# Altium schematic sheet Voices_All.SCHDOC
size B; Organization: Altium Limited; Address1: L3, 12a Rodborough Rd; Address2: Frenchs Forest; Address3: NSW; Address4: Australia 2086; DocumentNumber: 4; SheetNumber: 4; SheetTotal: 9
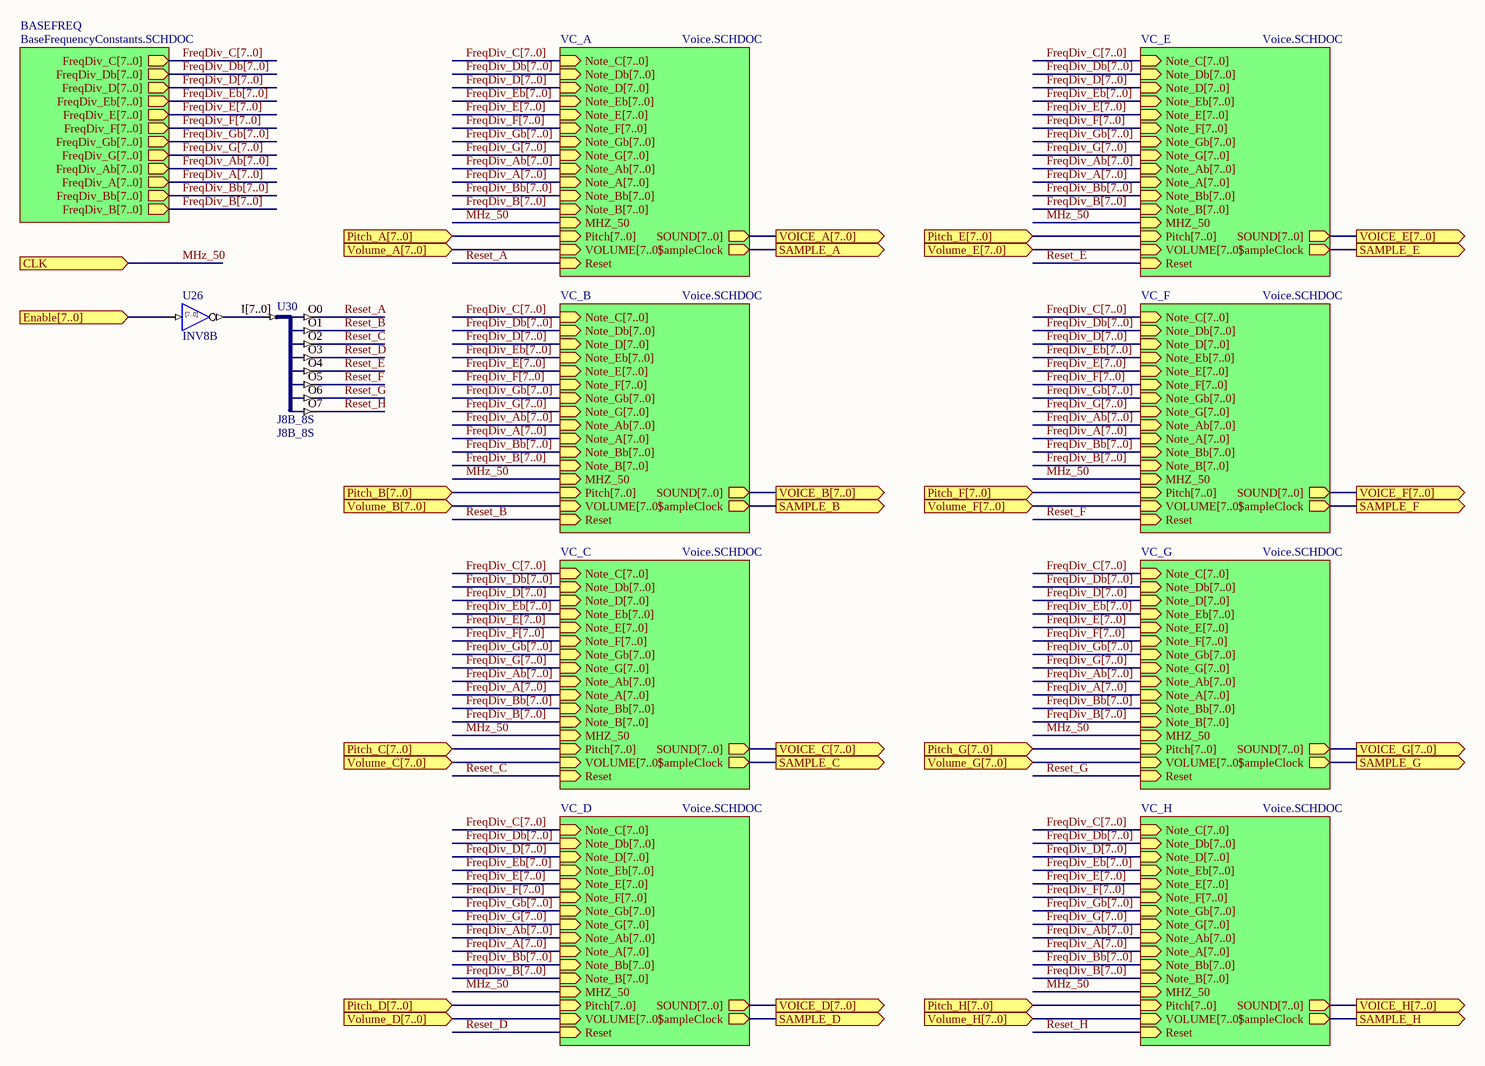
[diagram p0: Voices_All.SCHDOC]

## Parts
U26  INV8B
U30  J8B_8S

## Sub-sheets
BASEFREQ = BaseFrequencyConstants.SCHDOC: FreqDiv_C[7..0] (out), FreqDiv_A[7..0] (out), FreqDiv_B[7..0] (out), FreqDiv_Bb[7..0] (out), FreqDiv_D[7..0] (out), FreqDiv_Ab[7..0] (out), FreqDiv_G[7..0] (out), FreqDiv_Eb[7..0] (out), FreqDiv_E[7..0] (out), FreqDiv_Gb[7..0] (out), FreqDiv_F[7..0] (out), FreqDiv_Db[7..0] (out)
VC_A = Voice.SCHDOC: Note_C[7..0] (in), SampleClock (out), Note_A[7..0] (in), Note_B[7..0] (in), Note_Bb[7..0] (in), Note_D[7..0] (in), Note_Ab[7..0] (in), Note_G[7..0] (in), MHZ_50 (in), Note_Eb[7..0] (in), Pitch[7..0] (in), Note_E[7..0] (in), Note_Gb[7..0] (in), Note_F[7..0] (in), Note_Db[7..0] (in), Reset (in), SOUND[7..0] (out), VOLUME[7..0] (in)
VC_B = Voice.SCHDOC: Note_C[7..0] (in), SampleClock (out), Note_A[7..0] (in), Note_B[7..0] (in), Note_Bb[7..0] (in), Note_D[7..0] (in), Note_Ab[7..0] (in), Note_G[7..0] (in), MHZ_50 (in), Note_Eb[7..0] (in), Pitch[7..0] (in), Note_E[7..0] (in), Note_Gb[7..0] (in), Note_F[7..0] (in), Note_Db[7..0] (in), Reset (in), SOUND[7..0] (out), VOLUME[7..0] (in)
VC_C = Voice.SCHDOC: Note_C[7..0] (in), SampleClock (out), Note_A[7..0] (in), Note_B[7..0] (in), Note_Bb[7..0] (in), Note_D[7..0] (in), Note_Ab[7..0] (in), Note_G[7..0] (in), MHZ_50 (in), Note_Eb[7..0] (in), Pitch[7..0] (in), Note_E[7..0] (in), Note_Gb[7..0] (in), Note_F[7..0] (in), Note_Db[7..0] (in), Reset (in), SOUND[7..0] (out), VOLUME[7..0] (in)
VC_D = Voice.SCHDOC: Note_C[7..0] (in), SampleClock (out), Note_A[7..0] (in), Note_B[7..0] (in), Note_Bb[7..0] (in), Note_D[7..0] (in), Note_Ab[7..0] (in), Note_G[7..0] (in), MHZ_50 (in), Note_Eb[7..0] (in), Pitch[7..0] (in), Note_E[7..0] (in), Note_Gb[7..0] (in), Note_F[7..0] (in), Note_Db[7..0] (in), Reset (in), SOUND[7..0] (out), VOLUME[7..0] (in)
VC_E = Voice.SCHDOC: Note_C[7..0] (in), SampleClock (out), Note_A[7..0] (in), Note_B[7..0] (in), Note_Bb[7..0] (in), Note_D[7..0] (in), Note_Ab[7..0] (in), Note_G[7..0] (in), MHZ_50 (in), Note_Eb[7..0] (in), Pitch[7..0] (in), Note_E[7..0] (in), Note_Gb[7..0] (in), Note_F[7..0] (in), Note_Db[7..0] (in), Reset (in), SOUND[7..0] (out), VOLUME[7..0] (in)
VC_F = Voice.SCHDOC: Note_C[7..0] (in), SampleClock (out), Note_A[7..0] (in), Note_B[7..0] (in), Note_Bb[7..0] (in), Note_D[7..0] (in), Note_Ab[7..0] (in), Note_G[7..0] (in), MHZ_50 (in), Note_Eb[7..0] (in), Pitch[7..0] (in), Note_E[7..0] (in), Note_Gb[7..0] (in), Note_F[7..0] (in), Note_Db[7..0] (in), Reset (in), SOUND[7..0] (out), VOLUME[7..0] (in)
VC_G = Voice.SCHDOC: Note_C[7..0] (in), SampleClock (out), Note_A[7..0] (in), Note_B[7..0] (in), Note_Bb[7..0] (in), Note_D[7..0] (in), Note_Ab[7..0] (in), Note_G[7..0] (in), MHZ_50 (in), Note_Eb[7..0] (in), Pitch[7..0] (in), Note_E[7..0] (in), Note_Gb[7..0] (in), Note_F[7..0] (in), Note_Db[7..0] (in), Reset (in), SOUND[7..0] (out), VOLUME[7..0] (in)
VC_H = Voice.SCHDOC: Note_C[7..0] (in), SampleClock (out), Note_A[7..0] (in), Note_B[7..0] (in), Note_Bb[7..0] (in), Note_D[7..0] (in), Note_Ab[7..0] (in), Note_G[7..0] (in), MHZ_50 (in), Note_Eb[7..0] (in), Pitch[7..0] (in), Note_E[7..0] (in), Note_Gb[7..0] (in), Note_F[7..0] (in), Note_Db[7..0] (in), Reset (in), SOUND[7..0] (out), VOLUME[7..0] (in)

## Ports
CLK (in), Enable[7..0] (in), Pitch_A[7..0] (in), Pitch_B[7..0] (in), Pitch_C[7..0] (in), Pitch_D[7..0] (in), Pitch_E[7..0] (in), Pitch_F[7..0] (in), Pitch_G[7..0] (in), Pitch_H[7..0] (in), SAMPLE_A (out), SAMPLE_B (out), SAMPLE_C (out), SAMPLE_D (out), SAMPLE_E (out), SAMPLE_F (out), SAMPLE_G (out), SAMPLE_H (out), VOICE_A[7..0] (out), VOICE_B[7..0] (out), VOICE_C[7..0] (out), VOICE_D[7..0] (out), VOICE_E[7..0] (out), VOICE_F[7..0] (out), VOICE_G[7..0] (out), VOICE_H[7..0] (out), Volume_A[7..0] (in), Volume_B[7..0] (in), Volume_C[7..0] (in), Volume_D[7..0] (in), Volume_E[7..0] (in), Volume_F[7..0] (in), Volume_G[7..0] (in), Volume_H[7..0] (in)

## Nets
Enable[7..0]: U26.I[7..0] ; port Enable[7..0]
MHz_50: port CLK, sheet VC_A/MHZ_50, sheet VC_B/MHZ_50, sheet VC_C/MHZ_50, sheet VC_D/MHZ_50, sheet VC_E/MHZ_50, sheet VC_F/MHZ_50, sheet VC_G/MHZ_50, sheet VC_H/MHZ_50
Reset_A: U30.O0 ; sheet VC_A/Reset
Reset_B: U30.O1 ; sheet VC_B/Reset
Reset_C: U30.O2 ; sheet VC_C/Reset
Reset_D: U30.O3 ; sheet VC_D/Reset
Reset_E: U30.O4 ; sheet VC_E/Reset
Reset_F: U30.O5 ; sheet VC_F/Reset
Reset_G: U30.O6 ; sheet VC_G/Reset
Reset_H: U30.O7 ; sheet VC_H/Reset
SAMPLE_A: port SAMPLE_A, sheet VC_A/SampleClock
SAMPLE_B: port SAMPLE_B, sheet VC_B/SampleClock
SAMPLE_C: port SAMPLE_C, sheet VC_C/SampleClock
SAMPLE_D: port SAMPLE_D, sheet VC_D/SampleClock
SAMPLE_E: port SAMPLE_E, sheet VC_E/SampleClock
SAMPLE_F: port SAMPLE_F, sheet VC_F/SampleClock
SAMPLE_G: port SAMPLE_G, sheet VC_G/SampleClock
SAMPLE_H: port SAMPLE_H, sheet VC_H/SampleClock
NetU26_O[7..0]: U26.O[7..0] U30.I[7..0]

## Buses and harness runs
bus FreqDiv_A[7..0] = sheet BASEFREQ/FreqDiv_A[7..0]
bus FreqDiv_A[7..0] = sheet VC_A/Note_A[7..0]
bus FreqDiv_A[7..0] = sheet VC_B/Note_A[7..0]
bus FreqDiv_A[7..0] = sheet VC_C/Note_A[7..0]
bus FreqDiv_A[7..0] = sheet VC_D/Note_A[7..0]
bus FreqDiv_A[7..0] = sheet VC_E/Note_A[7..0]
bus FreqDiv_A[7..0] = sheet VC_F/Note_A[7..0]
bus FreqDiv_A[7..0] = sheet VC_G/Note_A[7..0]
bus FreqDiv_A[7..0] = sheet VC_H/Note_A[7..0]
bus FreqDiv_Ab[7..0] = sheet BASEFREQ/FreqDiv_Ab[7..0]
bus FreqDiv_Ab[7..0] = sheet VC_A/Note_Ab[7..0]
bus FreqDiv_Ab[7..0] = sheet VC_B/Note_Ab[7..0]
bus FreqDiv_Ab[7..0] = sheet VC_C/Note_Ab[7..0]
bus FreqDiv_Ab[7..0] = sheet VC_D/Note_Ab[7..0]
bus FreqDiv_Ab[7..0] = sheet VC_E/Note_Ab[7..0]
bus FreqDiv_Ab[7..0] = sheet VC_F/Note_Ab[7..0]
bus FreqDiv_Ab[7..0] = sheet VC_G/Note_Ab[7..0]
bus FreqDiv_Ab[7..0] = sheet VC_H/Note_Ab[7..0]
bus FreqDiv_B[7..0] = sheet BASEFREQ/FreqDiv_B[7..0]
bus FreqDiv_B[7..0] = sheet VC_A/Note_B[7..0]
bus FreqDiv_B[7..0] = sheet VC_B/Note_B[7..0]
bus FreqDiv_B[7..0] = sheet VC_C/Note_B[7..0]
bus FreqDiv_B[7..0] = sheet VC_D/Note_B[7..0]
bus FreqDiv_B[7..0] = sheet VC_E/Note_B[7..0]
bus FreqDiv_B[7..0] = sheet VC_F/Note_B[7..0]
bus FreqDiv_B[7..0] = sheet VC_G/Note_B[7..0]
bus FreqDiv_B[7..0] = sheet VC_H/Note_B[7..0]
bus FreqDiv_Bb[7..0] = sheet BASEFREQ/FreqDiv_Bb[7..0]
bus FreqDiv_Bb[7..0] = sheet VC_A/Note_Bb[7..0]
bus FreqDiv_Bb[7..0] = sheet VC_B/Note_Bb[7..0]
bus FreqDiv_Bb[7..0] = sheet VC_C/Note_Bb[7..0]
bus FreqDiv_Bb[7..0] = sheet VC_D/Note_Bb[7..0]
bus FreqDiv_Bb[7..0] = sheet VC_E/Note_Bb[7..0]
bus FreqDiv_Bb[7..0] = sheet VC_F/Note_Bb[7..0]
bus FreqDiv_Bb[7..0] = sheet VC_G/Note_Bb[7..0]
bus FreqDiv_Bb[7..0] = sheet VC_H/Note_Bb[7..0]
bus FreqDiv_C[7..0] = sheet BASEFREQ/FreqDiv_C[7..0]
bus FreqDiv_C[7..0] = sheet VC_A/Note_C[7..0]
bus FreqDiv_C[7..0] = sheet VC_B/Note_C[7..0]
bus FreqDiv_C[7..0] = sheet VC_C/Note_C[7..0]
bus FreqDiv_C[7..0] = sheet VC_D/Note_C[7..0]
bus FreqDiv_C[7..0] = sheet VC_E/Note_C[7..0]
bus FreqDiv_C[7..0] = sheet VC_F/Note_C[7..0]
bus FreqDiv_C[7..0] = sheet VC_G/Note_C[7..0]
bus FreqDiv_C[7..0] = sheet VC_H/Note_C[7..0]
bus FreqDiv_D[7..0] = sheet BASEFREQ/FreqDiv_D[7..0]
bus FreqDiv_D[7..0] = sheet VC_A/Note_D[7..0]
bus FreqDiv_D[7..0] = sheet VC_B/Note_D[7..0]
bus FreqDiv_D[7..0] = sheet VC_C/Note_D[7..0]
bus FreqDiv_D[7..0] = sheet VC_D/Note_D[7..0]
bus FreqDiv_D[7..0] = sheet VC_E/Note_D[7..0]
bus FreqDiv_D[7..0] = sheet VC_F/Note_D[7..0]
bus FreqDiv_D[7..0] = sheet VC_G/Note_D[7..0]
bus FreqDiv_D[7..0] = sheet VC_H/Note_D[7..0]
bus FreqDiv_Db[7..0] = sheet BASEFREQ/FreqDiv_Db[7..0]
bus FreqDiv_Db[7..0] = sheet VC_A/Note_Db[7..0]
bus FreqDiv_Db[7..0] = sheet VC_B/Note_Db[7..0]
bus FreqDiv_Db[7..0] = sheet VC_C/Note_Db[7..0]
bus FreqDiv_Db[7..0] = sheet VC_D/Note_Db[7..0]
bus FreqDiv_Db[7..0] = sheet VC_E/Note_Db[7..0]
bus FreqDiv_Db[7..0] = sheet VC_F/Note_Db[7..0]
bus FreqDiv_Db[7..0] = sheet VC_G/Note_Db[7..0]
bus FreqDiv_Db[7..0] = sheet VC_H/Note_Db[7..0]
bus FreqDiv_E[7..0] = sheet BASEFREQ/FreqDiv_E[7..0]
bus FreqDiv_E[7..0] = sheet VC_A/Note_E[7..0]
bus FreqDiv_E[7..0] = sheet VC_B/Note_E[7..0]
bus FreqDiv_E[7..0] = sheet VC_C/Note_E[7..0]
bus FreqDiv_E[7..0] = sheet VC_D/Note_E[7..0]
bus FreqDiv_E[7..0] = sheet VC_E/Note_E[7..0]
bus FreqDiv_E[7..0] = sheet VC_F/Note_E[7..0]
bus FreqDiv_E[7..0] = sheet VC_G/Note_E[7..0]
bus FreqDiv_E[7..0] = sheet VC_H/Note_E[7..0]
bus FreqDiv_Eb[7..0] = sheet BASEFREQ/FreqDiv_Eb[7..0]
bus FreqDiv_Eb[7..0] = sheet VC_A/Note_Eb[7..0]
bus FreqDiv_Eb[7..0] = sheet VC_B/Note_Eb[7..0]
bus FreqDiv_Eb[7..0] = sheet VC_C/Note_Eb[7..0]
bus FreqDiv_Eb[7..0] = sheet VC_D/Note_Eb[7..0]
bus FreqDiv_Eb[7..0] = sheet VC_E/Note_Eb[7..0]
bus FreqDiv_Eb[7..0] = sheet VC_F/Note_Eb[7..0]
bus FreqDiv_Eb[7..0] = sheet VC_G/Note_Eb[7..0]
bus FreqDiv_Eb[7..0] = sheet VC_H/Note_Eb[7..0]
bus FreqDiv_F[7..0] = sheet BASEFREQ/FreqDiv_F[7..0]
bus FreqDiv_F[7..0] = sheet VC_A/Note_F[7..0]
bus FreqDiv_F[7..0] = sheet VC_B/Note_F[7..0]
bus FreqDiv_F[7..0] = sheet VC_C/Note_F[7..0]
bus FreqDiv_F[7..0] = sheet VC_D/Note_F[7..0]
bus FreqDiv_F[7..0] = sheet VC_E/Note_F[7..0]
bus FreqDiv_F[7..0] = sheet VC_F/Note_F[7..0]
bus FreqDiv_F[7..0] = sheet VC_G/Note_F[7..0]
bus FreqDiv_F[7..0] = sheet VC_H/Note_F[7..0]
bus FreqDiv_G[7..0] = sheet BASEFREQ/FreqDiv_G[7..0]
bus FreqDiv_G[7..0] = sheet VC_A/Note_G[7..0]
bus FreqDiv_G[7..0] = sheet VC_B/Note_G[7..0]
bus FreqDiv_G[7..0] = sheet VC_C/Note_G[7..0]
bus FreqDiv_G[7..0] = sheet VC_D/Note_G[7..0]
bus FreqDiv_G[7..0] = sheet VC_E/Note_G[7..0]
bus FreqDiv_G[7..0] = sheet VC_F/Note_G[7..0]
bus FreqDiv_G[7..0] = sheet VC_G/Note_G[7..0]
bus FreqDiv_G[7..0] = sheet VC_H/Note_G[7..0]
bus FreqDiv_Gb[7..0] = sheet BASEFREQ/FreqDiv_Gb[7..0]
bus FreqDiv_Gb[7..0] = sheet VC_A/Note_Gb[7..0]
bus FreqDiv_Gb[7..0] = sheet VC_B/Note_Gb[7..0]
bus FreqDiv_Gb[7..0] = sheet VC_C/Note_Gb[7..0]
bus FreqDiv_Gb[7..0] = sheet VC_D/Note_Gb[7..0]
bus FreqDiv_Gb[7..0] = sheet VC_E/Note_Gb[7..0]
bus FreqDiv_Gb[7..0] = sheet VC_F/Note_Gb[7..0]
bus FreqDiv_Gb[7..0] = sheet VC_G/Note_Gb[7..0]
bus FreqDiv_Gb[7..0] = sheet VC_H/Note_Gb[7..0]
bus port Pitch_A[7..0] = sheet VC_A/Pitch[7..0]
bus port Pitch_B[7..0] = sheet VC_B/Pitch[7..0]
bus port Pitch_C[7..0] = sheet VC_C/Pitch[7..0]
bus port Pitch_D[7..0] = sheet VC_D/Pitch[7..0]
bus port Pitch_E[7..0] = sheet VC_E/Pitch[7..0]
bus port Pitch_F[7..0] = sheet VC_F/Pitch[7..0]
bus port Pitch_G[7..0] = sheet VC_G/Pitch[7..0]
bus port Pitch_H[7..0] = sheet VC_H/Pitch[7..0]
bus port VOICE_A[7..0] = sheet VC_A/SOUND[7..0]
bus port VOICE_B[7..0] = sheet VC_B/SOUND[7..0]
bus port VOICE_C[7..0] = sheet VC_C/SOUND[7..0]
bus port VOICE_D[7..0] = sheet VC_D/SOUND[7..0]
bus port VOICE_E[7..0] = sheet VC_E/SOUND[7..0]
bus port VOICE_F[7..0] = sheet VC_F/SOUND[7..0]
bus port VOICE_G[7..0] = sheet VC_G/SOUND[7..0]
bus port VOICE_H[7..0] = sheet VC_H/SOUND[7..0]
bus port Volume_A[7..0] = sheet VC_A/VOLUME[7..0]
bus port Volume_B[7..0] = sheet VC_B/VOLUME[7..0]
bus port Volume_C[7..0] = sheet VC_C/VOLUME[7..0]
bus port Volume_D[7..0] = sheet VC_D/VOLUME[7..0]
bus port Volume_E[7..0] = sheet VC_E/VOLUME[7..0]
bus port Volume_F[7..0] = sheet VC_F/VOLUME[7..0]
bus port Volume_G[7..0] = sheet VC_G/VOLUME[7..0]
bus port Volume_H[7..0] = sheet VC_H/VOLUME[7..0]

## Notes on the sheet
- Title
- Size:
- Date:
- B
- Number:
- Time:
- Revision:
- Sheet
- of
- File:
- (in symbol INV8B) [7..0]

## Library data of the parts
U26 = INV8B: 8-Bit Inverter, Bus Version; ArchiveName: GENERIC; Published: 18-Dec-2003; Publisher: Altium Limited; Core Revision: 1.00.00
U30 = J8B_8S: 8-Bit input bus to 8 single pin outputs; ArchiveName: GENERIC; Published: 18-Dec-2003; Publisher: Altium Limited; Core Revision: 1.00.00; Comment_1: J8B_8S